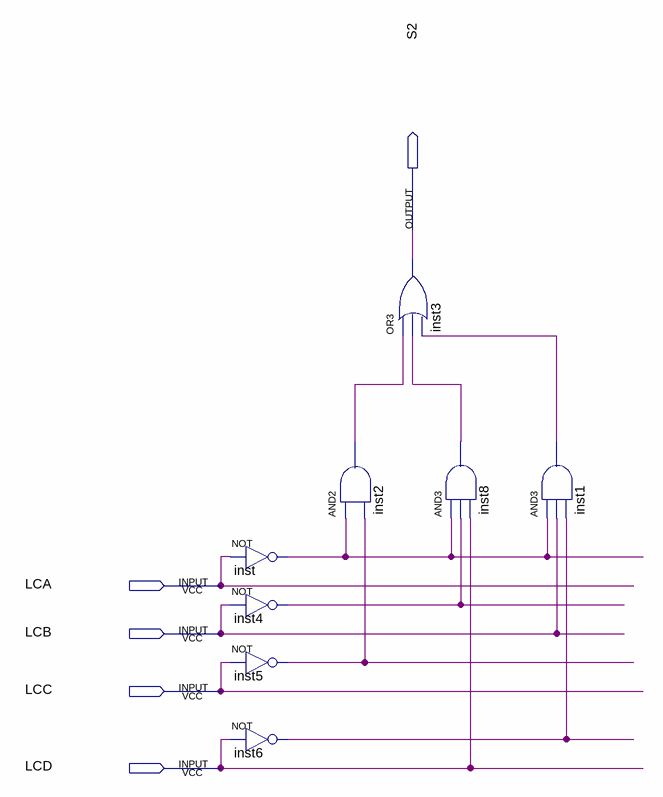
[diagram p0: schematic sheet]
// Quartus schematic Linha2.bdf as structural Verilog: 8 symbols, 5 pins
module Linha2 (
  input  LCA,
  input  LCB,
  input  LCC,
  input  LCD,
  output S2
);

  wire inst1_out, inst2_out, inst4_out, inst5_out, inst6_out, inst8_out, inst_out;

  not inst (inst_out, LCA);
  not inst4 (inst4_out, LCB);
  not inst5 (inst5_out, LCC);
  not inst6 (inst6_out, LCD);
  or inst3 (S2, inst2_out, inst8_out, inst1_out);
  and inst2 (inst2_out, inst_out, inst5_out);
  and inst8 (inst8_out, inst_out, inst4_out, LCD);
  and inst1 (inst1_out, inst_out, LCB, inst6_out);
endmodule
